# EAGLE design SolderingIronDriver-V1.5-PTH (EAGLE 5.11)
LEFT: PTC; PROJECT: Soldering Iron Driver V1.5; RIGHT: K-TC
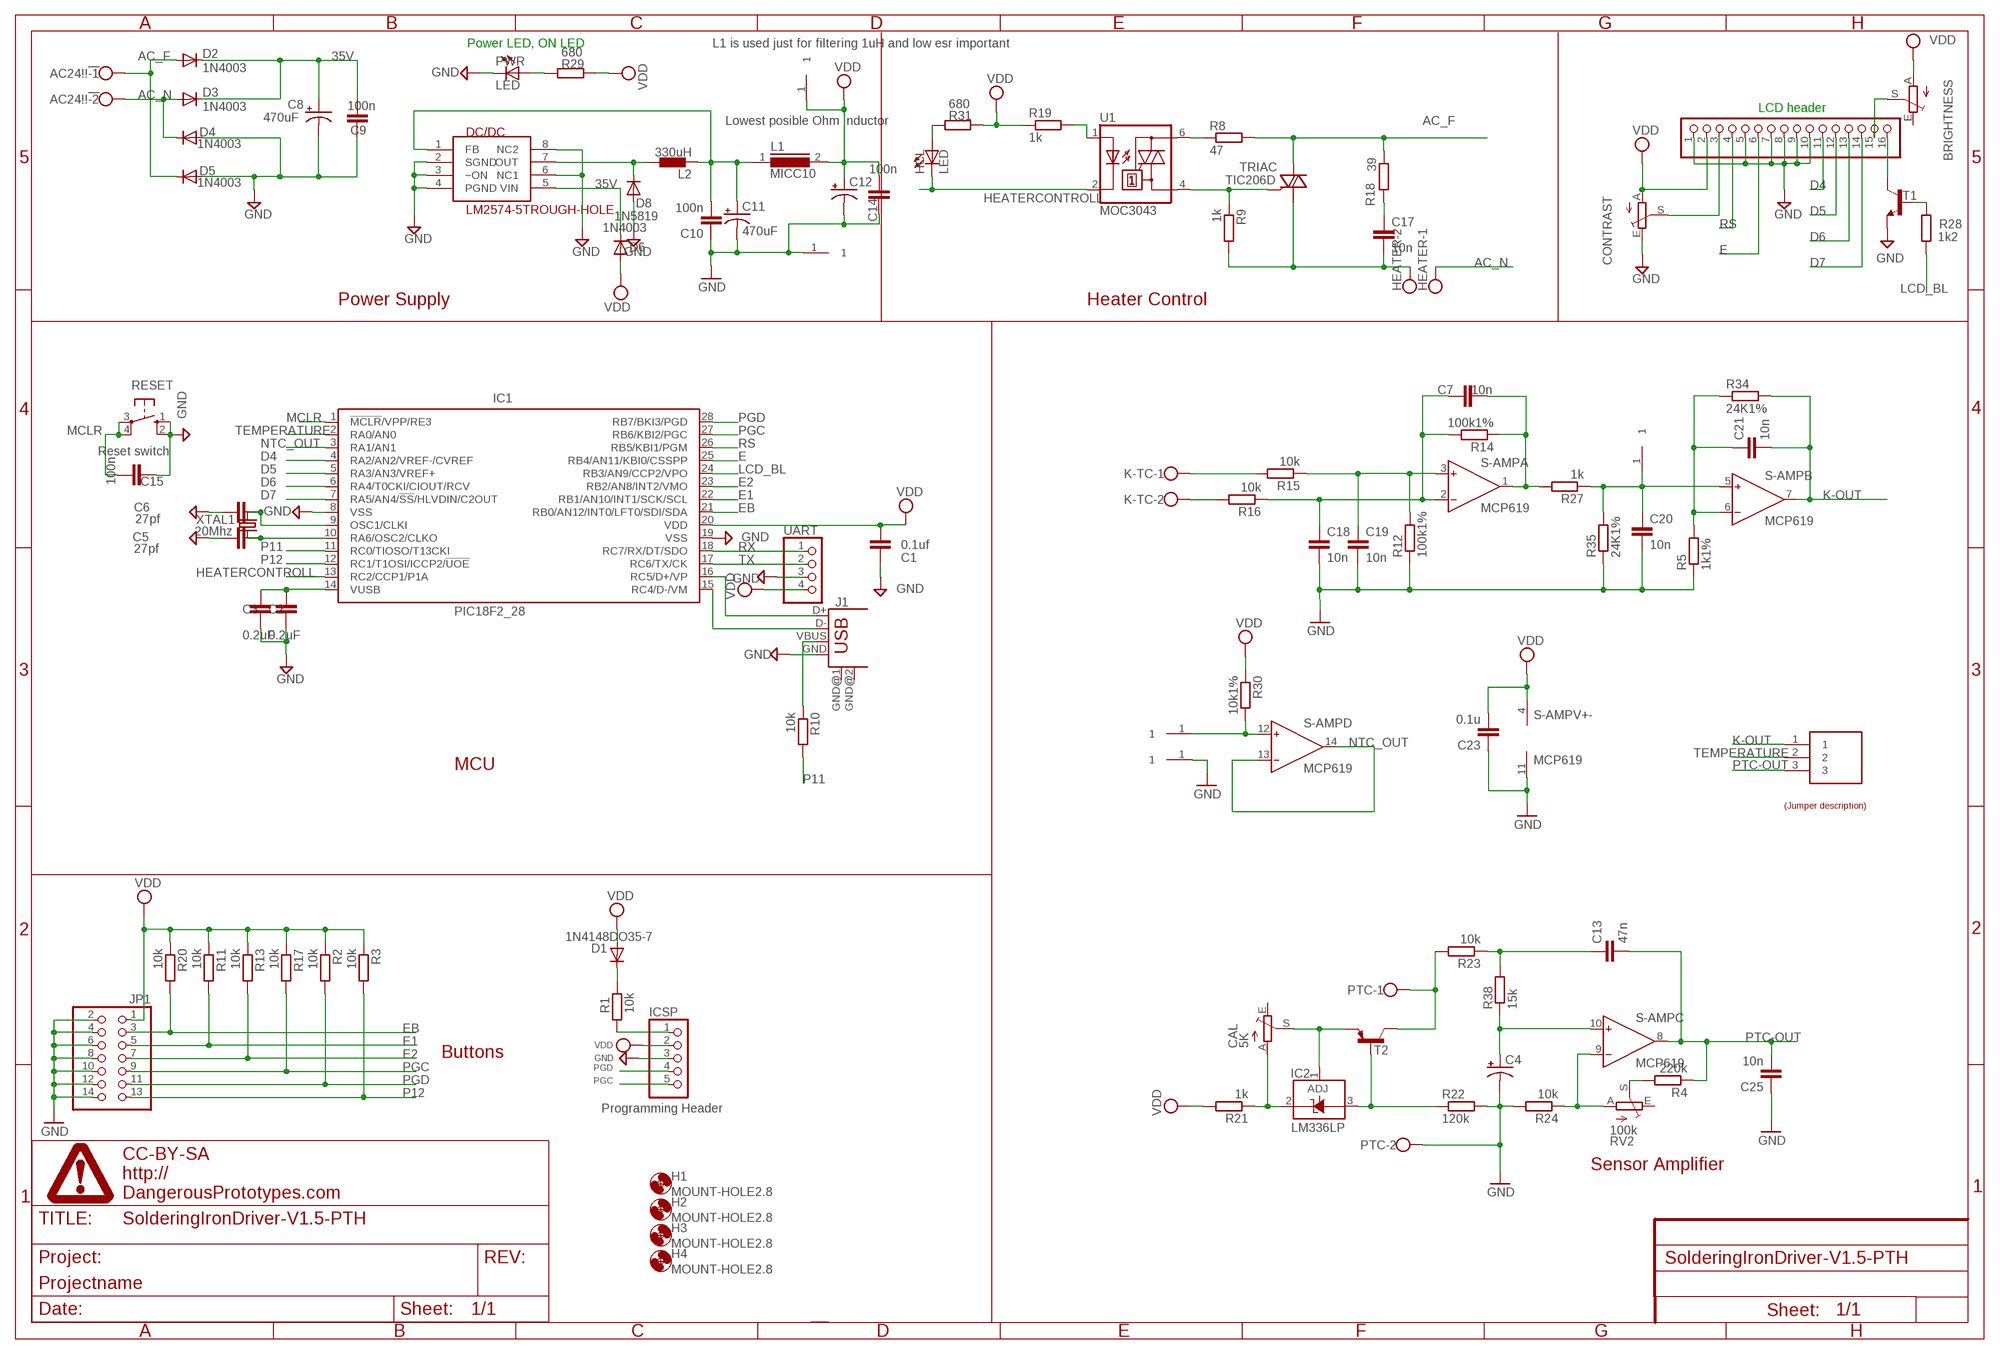
[diagram p0: schematic, sheet 1]

## Parts
5V  HEADER1X1PTH  [M1X1]
AC24!!!  W237-102  [W237-102]
AMP  HEADER1X1PTH  [M1X1]
BRIGHTNESS  TRIM_EU-B25P  [B25P]
C1  0.1uf  CAPDECOUPLING  [DEC]
C2  0.2uF  CAPDECOUPLING  [DEC]
C3  0.2uF  CAPDECOUPLING  [DEC]
C4  CAP_POLPTH2  [CPOL-RADIAL-10UF-25V]
C5  27pf  CAPDECOUPLING  [DEC]
C6  27pf  CAPDECOUPLING  [DEC]
C7  10n  CAPDECOUPLING  [DEC]
C8  470uF  CAP-ELD10-P200  [CAP-D10-P200MIL]
C9  100n  CAPDECOUPLING  [DEC]
C10  100n  CAPDECOUPLING  [DEC]
C11  470uF  CAP-ELD63MP100  [CAP-D6.3MM-P100MIL]
C12  CAP_POLPTH1  [CPOL-RADIAL-100UF-25V]
C13  47n  CAPDECOUPLING  [DEC]
C14  100n  CAPDECOUPLING  [DEC]
C15  100n  CAPDECOUPLING  [DEC]
C17  10n  CAPDECOUPLING  [DEC]
C18  10n  CAPDECOUPLING  [DEC]
C19  10n  CAPDECOUPLING  [DEC]
C20  10n  CAPDECOUPLING  [DEC]
C21  10n  CAPDECOUPLING  [DEC]
C23  0.1u  CAPDECOUPLING  [DEC]
C25  10n  CAPDECOUPLING  [DEC]
CAL  5K  TRIM_EU-RJ9W  [RJ9W]
CONTRAST  TRIM_EU-B25P  [B25P]
D1  1N4148DO35-7  [DO35-7]
D2  1N4003  DIODE-DO41-7.6  [DO41-7.6]
D3  1N4003  DIODE-DO41-7.6  [DO41-7.6]
D4  1N4003  DIODE-DO41-7.6  [DO41-7.6]
D5  1N4003  DIODE-DO41-7.6  [DO41-7.6]
D6  1N4003  DIODE-DO41-7.6  [DO41-7.6]
D8  1N5819  DIODE-DO41-7.6  [DO41-7.6]
DC/DC  LM2574-5TROUGH-HOLE  [DIL-08]
GND  HEADER1X1PTH  [M1X1]
H1  MOUNT-HOLE2.8  [2,8]
H2  MOUNT-HOLE2.8  [2,8]
H3  MOUNT-HOLE2.8  [2,8]
H4  MOUNT-HOLE2.8  [2,8]
HCL  LED  LED3MM  [LED3MM]
HEATER  W237-102  [W237-102]
IC1  PIC18F2_28  [SOCKET-28-3]
IC2  LM336LP  [TO92]
ICSP  PINHD-1X5  [1X05]
JP1  PINHD-2X7  [2X07]
K-TC  W237-102  [W237-102]
L1  MICC10  [MICC10]
L2  330uH  CL330UH  [CW8A]
LCD_HEADER  PINHD-1X16  [1X16]
NTC  HEADER1X1PTH  [M1X1]
ON/OFF2  HEADER1X1PTH  [M1X1]
PTC  W237-102  [W237-102]
PWR  LED  LED3MM  [LED3MM]
R1  10k  R-EU_0204/7  [0204/7]
R2  10k  RESISTORTH  [RTH025W]
R3  10k  RESISTORTH  [RTH025W]
R4  220k  RESISTORTH  [RTH025W]
R5  1k1%  RESISTORTH  [RTH025W]
R8  47  RESISTORTH  [RTH025W]
R9  1k  RESISTORTH  [RTH025W]
R10  10k  RESISTORTH  [RTH025W]
R11  10k  RESISTORTH  [RTH025W]
R12  100k1%  RESISTORTH  [RTH025W]
R13  10k  RESISTORTH  [RTH025W]
R14  100k1%  RESISTORTH  [RTH025W]
R15  10k  RESISTORTH  [RTH025W]
R16  10k  RESISTORTH  [RTH025W]
R17  10k  RESISTORTH  [RTH025W]
R18  39  RESISTORTH  [RTH025W]
R19  1k  RESISTORTH  [RTH025W]
R20  10k  RESISTORTH  [RTH025W]
R21  1k  RESISTORTH  [RTH025W]
R22  120k  RESISTORTH  [RTH025W]
R23  10k  RESISTORTH  [RTH025W]
R24  10k  RESISTORTH  [RTH025W]
R27  1k  RESISTORTH  [RTH025W]
R28  1k2  RESISTORTH  [RTH025W]
R29  680  RESISTORTH  [RTH025W]
R30  10k1%  RESISTORTH  [RTH025W]
R31  680  RESISTORTH  [RTH025W]
R34  24K1%  RESISTORTH  [RTH025W]
R35  24K1%  RESISTORTH  [RTH025W]
R38  15k  RESISTORTH  [RTH025W]
RESET  10-XX  [B3F-10XX]
RV2  100k  TRIM_EU-RJ9W  [RJ9W]
S-AMP  MCP619  [SOCKET-14]
SENSOR_SELECT  HEADER1X3PTH  [M1X3]
T1  BC337-40-NPN-TO92-CBE  [TO92-CBE]
T2  BJT-PNPTO92EBC  [TO92-EBC]
TRIAC  TIC206D  [TO220BV]
U1  MOC3043  MOC3043M  [DIL06]
U$1  DINA4_L  [DP_LOGO]
U$2  JUMP3_DESC  [JUMP3_DESC]
UART  PINHD-1X4  [1X04]
USB  USB  USB-B-H  [USB-B-H]
XTAL1  20Mhz  CRYSTALHC49U70  [HC49U70]

## Nets
35V: C8.+ C9.2 D2.C D3.C D6.C DC/DC.5(VIN)
AC_F: AC24!!!.1 D2.A D5.C R8.2 R18.1 TRIAC.T2(A2)
AC_N: AC24!!!.2 D3.A D4.C HEATER.1
D4: IC1.4(RA2/AN2/VREF-/CVREF) LCD_HEADER.11
D5: IC1.5(RA3/AN3/VREF+) LCD_HEADER.12
D6: IC1.6(RA4/T0CKI/CIOUT/RCV) LCD_HEADER.13
D7: IC1.7(RA5/AN4/!SS!/HLVDIN/C2OUT) LCD_HEADER.14
E: IC1.25(RB4/AN11/KBI0/CSSPP) LCD_HEADER.6
E1: IC1.22(RB1/AN10/INT1/SCK/SCL) JP1.5 R11.2
E2: IC1.23(RB2/AN8/INT2/VMO) JP1.7 R13.2
EB: IC1.21(RB0/AN12/INT0/LFT0/SDI/SDA) JP1.3 R20.2
GND: C1.2 C2.2 C3.2 C4.2(-) C5.2 C6.2 C8.- C9.1 C10.1 C11.- C12.2(-) C14.1 C15.1 C18.2 C19.2 C20.2 C23.1 C25.1 CONTRAST.E D4.A D5.A D8.A DC/DC.2(SGND) DC/DC.3(~ON) DC/DC.4(PGND) DC/DC.6(NC1) DC/DC.8(NC2) GND.1 IC1.8(VSS) IC1.19(VSS) ICSP.3 JP1.2 JP1.4 JP1.6 JP1.8 JP1.10 JP1.12 JP1.14 LCD_HEADER.1 LCD_HEADER.5 LCD_HEADER.7 LCD_HEADER.8 LCD_HEADER.9 LCD_HEADER.10 ON/OFF2.1 PTC.2 PWR.K(C) R5.1 R12.1 R22.2 R24.2 R35.1 RESET.1(S) RESET.2(S1) S-AMP.11(V+-:V-) T1.E UART.3 USB.GND
HEATERCONTROLL: HCL.K(C) IC1.13(RC2/CCP1/P1A) U1.2(C)
K-OUT: C21.2 R34.2 S-AMP.7(B:OUT) SENSOR_SELECT.1
LCD_BL: IC1.24(RB3/AN9/CCP2/VPO) R28.2
MCLR: C15.2 IC1.1(!MCLR!/VPP/RE3) ICSP.1 R1.1 RESET.3(P) RESET.4(P1)
N$1: C6.1 IC1.9(OSC1/CLKI) XTAL1.2
N$2: C5.1 IC1.10(RA6/OSC2/CLKO) XTAL1.1
N$3: R10.1 USB.VBUS
N$4: C10.2 C11.+ DC/DC.1(FB) L1.1 L2.1
N$5: R28.1 T1.B
N$6: HCL.A R31.1
N$7: R4.2 RV2.S
N$10: D1.C R1.2
N$11: LCD_HEADER.16 T1.C
N$12: BRIGHTNESS.S LCD_HEADER.15
N$14: C2.1 C3.1 IC1.14(VUSB)
N$16: K-TC.1 R15.2
N$17: CAL.S IC2.1(ADJ) T2.E
N$19: C17.1 R18.2
N$20: R9.1 TRIAC.G U1.4(A1)
N$21: R8.1 U1.6(A2)
N$22: R19.2 U1.1(A)
N$23: C13.1 R23.1 R38.2
N$24: NTC.1 R30.2 S-AMP.12(D:IN+)
N$25: K-TC.2 R16.2
N$26: C7.1 C18.1 R14.2 R16.1 S-AMP.2(A:IN-)
N$27: C19.1 R12.2 R15.1 S-AMP.3(A:IN+)
N$28: C7.2 R14.1 R27.2 S-AMP.1(A:OUT)
N$29: IC2.3(A) R22.1 T2.B
N$30: CAL.A IC2.2(C) R21.1
N$31: AMP.1 C20.1 R27.1 R35.2 S-AMP.5(B:IN+)
N$32: C21.1 R5.2 R34.1 S-AMP.6(B:IN-)
N$33: C4.1(+) R38.1 S-AMP.10(C:IN+)
N$34: PTC.1 R23.2 T2.C
N$37: R24.1 RV2.A S-AMP.9(C:IN-)
N$38: PWR.A R29.1
N$46: CONTRAST.S LCD_HEADER.3
NTC_OUT: IC1.3(RA1/AN1) S-AMP.13(D:IN-) S-AMP.14(D:OUT)
P11: IC1.11(RC0/TIOSO/T13CKI) R10.2
P12: IC1.12(RC1/T1OSI/ICCP2/!UOE) JP1.13 R3.2
PGC: IC1.27(RB6/KBI2/PGC) ICSP.5 JP1.9 R17.2
PGD: IC1.28(RB7/BKI3/PGD) ICSP.4 JP1.11 R2.2
PTC-OUT: C13.2 C25.2 R4.1 S-AMP.8(C:OUT) SENSOR_SELECT.3
RC4: IC1.15(RC4/D-/VM) USB.D-
RC5: IC1.16(RC5/D+/VP) USB.D+
RS: IC1.26(RB5/KBI1/PGM) LCD_HEADER.4
RX: IC1.18(RC7/RX/DT/SDO) UART.1
SW-OUT: D8.C DC/DC.7(OUT) L2.2
TEMPERATURE: IC1.2(RA0/AN0) SENSOR_SELECT.2
TX: IC1.17(RC6/TX/CK) UART.2
VDD: 5V.1 BRIGHTNESS.A C1.1 C12.1(+) C14.2 C23.2 CONTRAST.A D1.A D6.A IC1.20(VDD) ICSP.2 JP1.1 L1.2 LCD_HEADER.2 R2.1 R3.1 R11.1 R13.1 R17.1 R19.1 R20.1 R21.2 R29.2 R30.1 R31.2 S-AMP.4(V+-:V+) UART.4
WHATEVER: C17.2 HEATER.2 R9.2 TRIAC.T1(A1)
Unconnected: BRIGHTNESS.E CAL.E RV2.E USB.GND@1(GND) USB.GND@2(GND)

## Notes on the sheet
- Power LED, ON LED | L1 is used just for filtering 1uH and low esr important
- LCD header
- Lowest posible Ohm Inductor
- Power Supply | Heater Control
- Reset switch
- J1
- MCU
- Buttons
- Programming Header
- Sensor Amplifier

## Library data of the parts
5V AMP GND NTC ON/OFF2 = dp_devices:HEADER1X1
AC24!!! HEATER K-TC PTC = con-wago-500:W237-102: WAGO SCREW CLAMP; MPN: 237-102; OC_FARNELL: unknown; OC_NEWARK: 70K9898
BRIGHTNESS CONTRAST = pot:TRIM_EU-: POTENTIOMETER
C1-C3 C5-C7 C9 C10 C13-C15 C17-C21 C23 C25 = dp_devices:CAP
C4 C12 = SparkFun:CAP_POL: Capacitor Polarized These are standard SMD and PTH capacitors. Normally 10uF, 47uF, and 100uF in electrolytic and tantalum varieties. Always verify the external diameter of the through hole cap, it varies with capacity, voltage, and manufacturer. The EIA devices should be standard.
C8 C11 = fica:CAP-EL
CAL RV2 = fica2:TRIM_EU-: POTENTIOMETER
D1 = diode:1N4148: DIODE high speed (Philips)
D2-D6 D8 = diode:DIODE-: DIODE
DC/DC = fica:LM2574-5
H1-H4 = holes:MOUNT-HOLE: MOUNTING HOLE with drill center marker
HCL PWR = led:LED: LED OSRAM: - CHIPLED LG R971, LG N971, LY N971, LG Q971, LY Q971, LO R971, LY R971 LH N974, LH R974 LS Q976, LO Q976, LY Q976 LO Q996 - Hyper CHIPLED LW Q18S LB Q993, LB Q99A, LB R99A - SideLED LS A670, LO A670, LY A670, LG A670, LP A670 LB A673, LV A673, LT A673, LW A673 LH A674 LY A675 LS A676, LA A676, LO A676, LY A676, LW A676 LS A679, LY A679, LG A679 - Hyper Micro SIDELED® LS Y876, LA Y876, LO Y876, LY Y876 LT Y87S - SmartLED LW L88C, LW L88S LB L89C, LB L89S, LG L890 LS L89K, LO L89K, LY L89K LS L896, LA L896, LO L896, LY L896 - TOPLED LS T670, LO T670, LY T670, LG T670, LP T670 LSG T670, LSP T670, LSY T670, LOP T670, LYG T670 LG T671, LOG T671, LSG T671 LB T673, LV T673, LT T673, LW T673 LH T674 LS T676, LA T676, LO T676, LY T676, LB T676, LH T676, LSB T676, LW T676 LB T67C, LV T67C, LT T67C, LS T67K, LO T67K, LY T67K, LW E67C LS E67B, LA E67B, LO E67B, LY E67B, LB E67C, LV E67C, LT E67C LW T67C LS T679, LY T679, LG T679 LS T770, LO T770, LY T770, LG T770, LP T770 LB T773, LV T773, LT T773, LW T773 LH T774 LS E675, LA E675, LY E675, LS T675 LS T776, LA T776, LO T776, LY T776, LB T776 LHGB T686 LT T68C, LB T68C - Hyper Mini TOPLED® LB M676 - Mini TOPLED Santana® LG M470 LS M47K, LO M47K, LY M47K Source: http://www.osram.convergy.de LUXEON: - LUMILED® LXK2-PW12-R00, LXK2-PW12-S00, LXK2-PW14-U00, LXK2-PW14-V00 LXK2-PM12-R00, LXK2-PM12-S00, LXK2-PM14-U00 LXK2-PE12-Q00, LXK2-PE12-R00, LXK2-PE12-S00, LXK2-PE14-T00, LXK2-PE14-U00 LXK2-PB12-K00, LXK2-PB12-L00, LXK2-PB12-M00, LXK2-PB14-N00, LXK2-PB14-P00, LXK2-PB14-Q00 LXK2-PR12-L00, LXK2-PR12-M00, LXK2-PR14-Q00, LXK2-PR14-R00 LXK2-PD12-Q00, LXK2-PD12-R00, LXK2-PD12-S00 LXK2-PH12-R00, LXK2-PH12-S00 LXK2-PL12-P00, LXK2-PL12-Q00, LXK2-PL12-R00 Source: www.luxeon.com KINGBRIGHT: KA-3528ASYC Source: www.kingbright.com
IC1 = microchip:PIC18F2*_28: USB Microcontrollers with nanoWatt Technology High-Performance, Enhanced Flash, 28/40/44-Pin, Source: http://ww1.microchip.com/downloads/en/devicedoc/39632c.pdf
IC2 = linear:LM336: 2.5-V INTEGRATED REFERENCE CIRCUITS LM236 Source: http://focus.ti.com/lit/ds/symlink/lm336-2.5.pdf
ICSP = pinhead-2:PINHD-1X5: PIN HEADER
JP1 = pinhead:PINHD-2X7: PIN HEADER
L1 = inductors:MICC10: INDUCTOR
L2 = fica:CL330UH
LCD_HEADER = fica:PINHD-1X16: PIN HEADER
R1 = rcl:R-EU_: RESISTOR, European symbol
R2-R5 R8-R24 R27-R31 R34 R35 R38 = dp_devices:RESISTOR
RESET = switch-omron:10-XX: OMRON SWITCH; MPN: B3F-1000; OC_FARNELL: 176432; OC_NEWARK: 36M3542
S-AMP = fica2:MCP619
SENSOR_SELECT = DP2:HEADER1X3
T1 = transistor:*-NPN-: NPN Transistror BF959 corrected 2008.03.06
T2 = DP2:BJT-PNP: Most commonly used is SOT23-BEC
TRIAC = triac:TIC206: TRIAC Source: http://www.bourns.com/pdfs/tic206.pdf
U1 = optocoupler:MOC30*: 6-Pin DIP Zero-Cross Optoisolators Triac Driver Output (250/400 Volt Peak) Source: http://www.fairchildsemi.com/ds/MO/MOC3043-M.pdf; MF: FAIRCHILD SEMICONDUCTOR; MPN: MOC3043-M; OC_FARNELL: 1021371; OC_NEWARK: 72K8900
U$1 = DP2:DINA4_L: A4 DP frame Standard Dangerous Prototypes schematic frame. Automagically adds the DP logo and standard texts to the PCB Use the atrribute in the schematic editor to change the fields.; FF1: fulfillment by; FF2: Seeed Studio; FF3: www.seeedstudio.com; LICENSE: CC-BY-SA; PROJECT: Projectname; URL1: http://; URL2: DangerousPrototypes.com
U$2 = DP2:JUMP3_DESC: Nice formatted three legged jumperdescription Use attributes to change the values LEFT = With jumper to the left RIGHT = With jumper to the right; LEFT: left; RIGHT: right
UART = pinhead:PINHD-1X4: PIN HEADER
USB = con-usb-2:USB: USB Connectors
XTAL1 = crystal:CRYSTAL: CRYSTAL; OC_FARNELL: unknown; OC_NEWARK: unknown

## Board
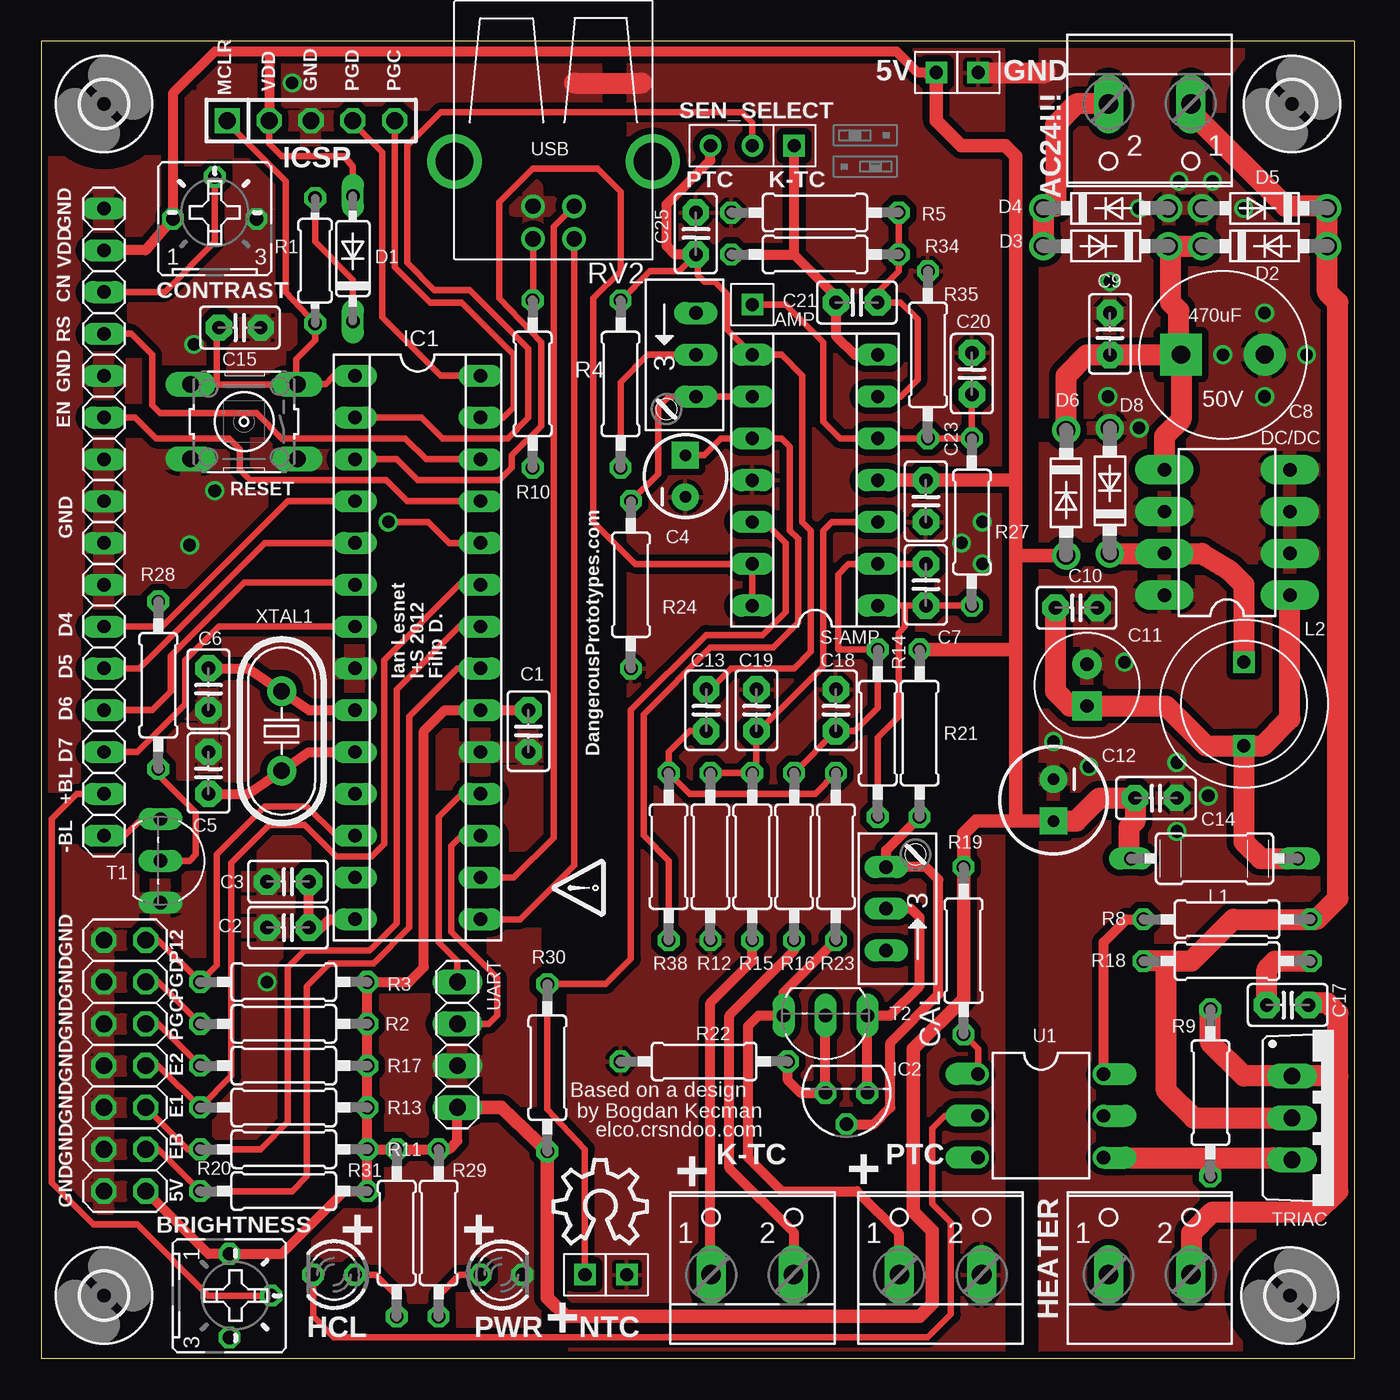
[diagram p1: board, top side]
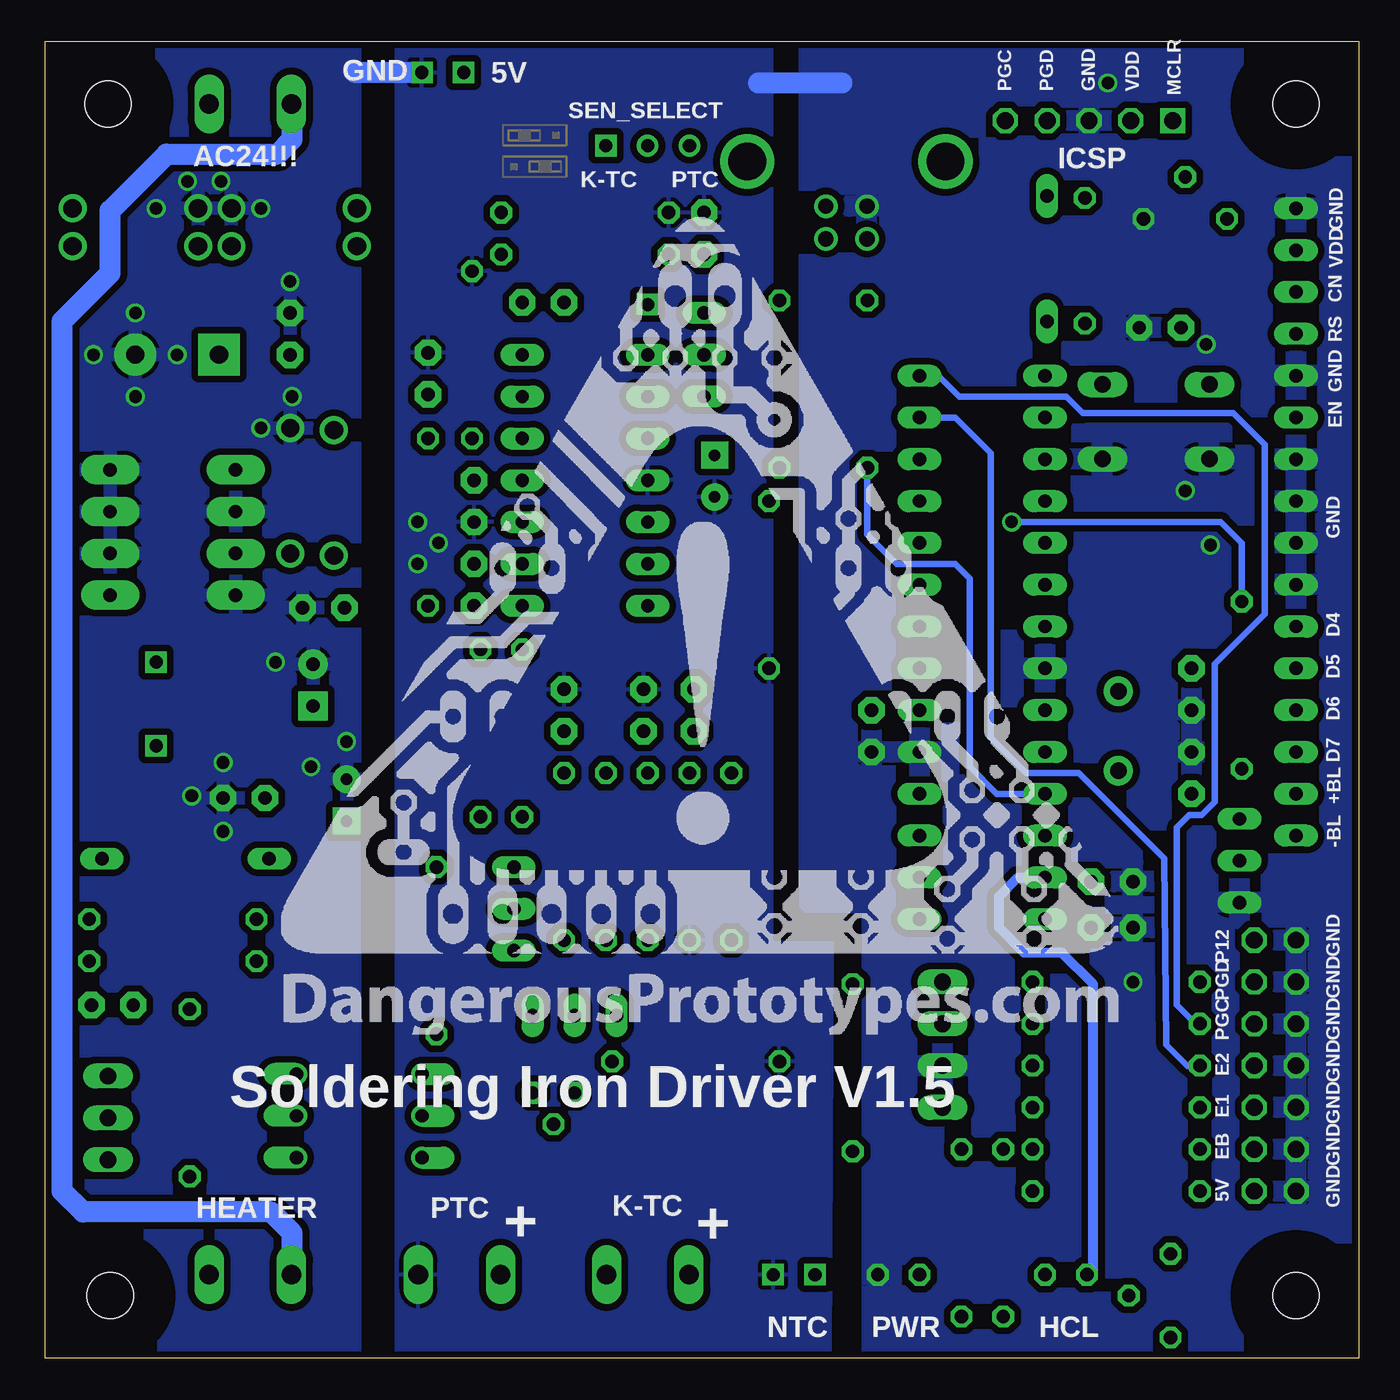
[diagram p2: board, bottom side, seen from below]

Size 79.76 x 80.01 mm. Coordinates in mm from the lower left corner, seen from the top.
Outline: 0,0 79.76,0 79.76,80.01 0,80.01 0,0
Copper layers (1*16): Top 0.035mm / dielectric 1.5mm / Bottom 0.035mm
Design rules "Fusion_eagle_rule_v1.1 *": minimum track width 6mil, minimum drill 12mil, track to track 10mil, track to pad 10mil, pad to pad 10mil, via to via 10mil, smd to smd 0mil, copper to edge 10mil, drill to drill 10mil, minimum pad ring 10mil, minimum via ring 6mil, stop-mask expansion 2mil, vias tented up to drill 100mil, thermal gap 10mil

### Footprints (pad centres in the part's own frame; a part is rotated, then mirrored left to right if it is on the bottom)
M1X1 = drill 0.8 square: 1 0,0
W237-102 = drill 1.194 long: 1 -2.5,-1.27; 2 2.5,-1.27
B25P = drill 0.813 octagon: A -2.54,0; E 2.54,0; S 0,2.54
DEC = drill 0.813 pad 1.6 octagon: 1 -1.27,0; 2 1.27,0
CPOL-RADIAL-10UF-25V = drill 0.7 pad 1.651 square: 1 1.27,0 | drill 0.7 pad 1.651 round: 2 -1.27,0
CAP-D10-P200MIL = drill 1.1 pad 2.54 square: + -2.54,0 | drill 1.1 pad 2.54 round: - 2.54,0
CAP-D6.3MM-P100MIL = drill 0.8 pad 1.778 square: + -1.27,0 | drill 0.8 pad 1.778 round: - 1.27,0
CPOL-RADIAL-100UF-25V = drill 0.7 pad 1.651 square: 1 1.27,0 | drill 0.7 pad 1.651 round: 2 -1.27,0
RJ9W = drill 0.813 long: A 2.54,0.635; E -2.54,0.635; S 0,0.635
DO35-7 = drill 0.813 long: A 3.81,0; C -3.81,0
DO41-7.6 = drill 1.1 pad 1.7 round: A 3.81,0; C -3.81,0
DIL-08 = drill 0.813 pad 1.778 long: 1 -3.81,-3.81; 2 -1.27,-3.81; 3 1.27,-3.81; 4 3.81,-3.81; 5 3.81,3.81; 6 1.27,3.81; 7 -1.27,3.81; 8 -3.81,3.81
2,8 = hole 2.8: 0,0
LED3MM = drill 0.813 octagon: A -1.27,0; K 1.27,0
SOCKET-28-3 = drill 0.813 long: 1 -16.51,-3.81; 2 -13.97,-3.81; 3 -11.43,-3.81; 4 -8.89,-3.81; 5 -6.35,-3.81; 6 -3.81,-3.81; 7 -1.27,-3.81; 8 1.27,-3.81; 9 3.81,-3.81; 10 6.35,-3.81; 11 8.89,-3.81; 12 11.43,-3.81; 13 13.97,-3.81; 14 16.51,-3.81; 15 16.51,3.81; 16 13.97,3.81; 17 11.43,3.81; 18 8.89,3.81; 19 6.35,3.81; 20 3.81,3.81; 21 1.27,3.81; 22 -1.27,3.81; 23 -3.81,3.81; 24 -6.35,3.81; 25 -8.89,3.81; 26 -11.43,3.81; 27 -13.97,3.81; 28 -16.51,3.81
TO92 = drill 0.813 octagon: 1 -1.27,0; 2 0,1.905; 3 1.27,0
1X05 = drill 1.016 square: 1 -5.08,0 | drill 1.016 octagon: 2 -2.54,0; 3 0,0; 4 2.54,0; 5 5.08,0
2X07 = drill 1.016 octagon: 1 -7.62,-1.27; 2 -7.62,1.27; 3 -5.08,-1.27; 4 -5.08,1.27; 5 -2.54,-1.27; 6 -2.54,1.27; 7 0,-1.27; 8 0,1.27; 9 2.54,-1.27; 10 2.54,1.27; 11 5.08,-1.27; 12 5.08,1.27; 13 7.62,-1.27; 14 7.62,1.27
MICC10 = drill 0.813 long: 1 -5.08,0; 2 5.08,0
CW8A = drill 0.8 square: 1 -2.54,0; 2 2.54,0
1X16 = drill 0.813 long: 1 -19.05,0; 2 -16.51,0; 3 -13.97,0; 4 -11.43,0; 5 -8.89,0; 6 -6.35,0; 7 -3.81,0; 8 -1.27,0; 9 1.27,0; 10 3.81,0; 11 6.35,0; 12 8.89,0; 13 11.43,0; 14 13.97,0; 15 16.51,0; 16 19.05,0
0204/7 = drill 0.813 octagon: 1 -3.81,0; 2 3.81,0
RTH025W = drill 0.813 octagon: 1 -5.08,0; 2 5.08,0
B3F-10XX = drill 1.016 long: 1 -3.251,2.261; 2 3.251,2.261; 3 -3.251,-2.261; 4 3.251,-2.261
SOCKET-14 = drill 0.813 long: 1 -7.62,-3.81; 2 -5.08,-3.81; 3 -2.54,-3.81; 4 0,-3.81; 5 2.54,-3.81; 6 5.08,-3.81; 7 7.62,-3.81; 8 7.62,3.81; 9 5.08,3.81; 10 2.54,3.81; 11 0,3.81; 12 -2.54,3.81; 13 -5.08,3.81; 14 -7.62,3.81
M1X3 = drill 0.8 square: 1 0,0 | drill 0.8 round: 2 2.54,0; 3 5.08,0
TO92-CBE = drill 0.813 long: B 0,0; C -2.54,0; E 2.54,0
TO92-EBC = drill 0.813 long: B 0,0; C 2.54,0; E -2.54,0
TO220BV = drill 1.016 long: G 2.54,-2.54; T1 -2.54,-2.54; T2 0,-2.54
DIL06 = drill 0.813 offset: 1 -2.54,-3.81; 2 0,-3.81; 3 2.54,-3.81; 4 2.54,3.81; 5 0,3.81; 6 -2.54,3.81
1X04 = drill 1.016 long: 1 -3.81,0; 2 -1.27,0; 3 1.27,0; 4 3.81,0
USB-B-H = drill 0.914 round: D+ 0,1.25; D- 1.981,1.25; GND 0,-1.25; VBUS 1.981,-1.25 | drill 2.286 round: GND@1 -2.718,6.02; GND@2 -2.718,-6.02
HC49U70 = drill 1 pad 1.778 round: 1 -2.413,0; 2 2.413,0

### Placement (x,y rotation side)
5V  54.36,78.11 0 top
AC24!!!  67.31,74.93 180 top
AMP  43.18,64.01 90 top
BRIGHTNESS  11.43,3.81 270 top
C1  29.59,38.1 270 top
C2  14.99,26.16 180 top
C3  14.99,28.96 180 top
C4  39.12,53.59 90 top
C5  10.16,35.56 90 top
C6  10.16,40.64 270 top
C7  53.72,46.99 270 top
C8  71.75,60.96 0 top
C9  64.9,62.23 270 top
C10  62.87,45.59 180 top
C11  63.5,40.89 90 top
C12  61.47,33.91 270 top
C13  40.39,39.37 90 top
C14  67.69,34.04 180 top
C15  12.06,62.61 180 top
C17  75.69,21.46 0 top
C18  48.26,39.37 90 top
C19  43.43,39.37 90 top
C20  56.52,59.82 90 top
C21  49.53,64.14 180 top
C23  53.72,52.07 90 top
C25  39.75,68.33 270 top
CAL  51.94,27.3 90 top
CONTRAST  10.54,69.22 0 top
D1  18.92,66.8 90 top
D2  74.3,67.56 0 top
D3  64.64,67.56 180 top
D4  64.64,69.85 0 top
D5  74.3,69.85 180 top
D6  62.23,52.58 270 top
D8  64.9,52.7 90 top
DC/DC  72.01,50.16 90 top
GND  56.9,78.11 0 top
H1  75.82,3.81 0 top
H2  75.95,76.2 0 top
H3  3.81,3.81 0 top
H4  3.81,76.2 0 top
HCL  17.78,5.08 180 top
HEATER  67.31,6.35 0 top
IC1  22.86,43.18 270 top
IC2  48.9,16.13 180 top
ICSP  16.38,75.18 0 top
JP1  5.08,17.78 90 top
K-TC  43.18,6.35 0 top
L1  71.25,30.35 180 top
L2  73.03,39.75 90 top
LCD_HEADER  3.81,50.8 270 top
NTC  33.02,5.08 0 top
ON/OFF2  35.56,5.08 0 top
PTC  54.61,6.35 0 top
PWR  27.94,5.08 0 top
R1  16.64,66.67 90 top
R2  14.73,20.32 180 top
R3  14.73,22.86 180 top
R4  35.18,59.18 270 top
R5  46.99,69.6 0 top
R8  72.01,26.67 0 top
R9  70.99,16.13 90 top
R10  29.84,59.18 270 top
R11  14.73,12.7 180 top
R12  40.64,30.48 90 top
R13  14.73,15.24 180 top
R14  50.8,37.97 90 top
R15  43.18,30.48 270 top
R16  45.72,30.48 270 top
R17  14.73,17.78 180 top
R18  72.01,24.13 0 top
R19  56.01,24.77 270 top
R20  14.73,10.16 180 top
R21  53.34,37.97 90 top
R22  40.26,18.03 180 top
R23  48.26,30.48 270 top
R24  35.81,46.99 270 top
R27  56.52,50.8 270 top
R28  7.11,40.89 90 top
R29  24.13,7.62 90 top
R30  30.73,17.65 90 top
R31  21.59,7.62 90 top
R34  46.99,67.06 180 top
R35  53.85,60.96 270 top
R38  38.1,30.48 90 top
RESET  12.32,56.9 180 top
RV2  39.12,60.96 270 top
S-AMP  46.99,53.34 90 top
SENSOR_SELECT  45.72,73.66 180 top
T1  7.24,30.23 270 top
T2  47.62,20.83 180 top
TRIAC  78.49,14.61 270 top
U1  60.71,14.73 270 top
U$1  33.66,28.57 90 top
U$2  53.21,73.03 0 top
U$3  JUMP3_DESC  [JUMP3_DESC]  46.86,73.03 0 bottom
U$4  [DP_LOGO_ART_2X2]  65.41,19.68 0 bottom
U$5  [OSHW_10X200_NOTEXT]  31.11,6.99 0 top
UART  25.27,19.05 270 top
USB  31.11,69.98 270 top
XTAL1  14.61,38.1 90 top

### Tracks (layer width: path | path; a pad name or v marks a point on that pad's centre or on a via)
35V
  Top 1.27: DC/DC.5 68.2,56.01 69.22,57.02 C8.+ | C8.+ C9.2 63.5,60.96 62.23,59.69 D6.C | C8.+ 69.09,61.09 69.09,63.63 68.58,64.14 68.58,67.44 D3.C D2.C
AC_F
  Top 1.27: 68.71,24.13 R18.1 | 68.71,24.13 69.85,24.13 72.39,26.67 R8.2 77.47,26.67 78.74,27.94 78.74,64.14 78.11,64.77 D2.A D5.C 77.98,69.98 75.56,69.98 69.81,75.73 AC24!!!.1 | TRIAC.T2 69.98,14.61 68.33,16.26 68.33,23.75 68.71,24.13
AC_N
  Top 1.27: AC24!!!.2 62.87,76.2 61.59,74.93 61.59,69.98 D4.C D3.A
  Bottom 1.27: 64.9,4.99 HEATER.1 64.77,5.12 64.77,7.62 66.04,8.89 77.47,8.89 78.74,10.16 78.74,62.99 75.82,65.91 75.82,69.72 72.39,73.15 65.66,73.15 64.77,74.04 64.77,76.16 AC24!!!.2
D4
  Top 0.406: LCD_HEADER.11 7.37,44.45 14.99,52.07 IC1.4
D5
  Top 0.406: IC1.5 13.59,49.53 5.97,41.91 LCD_HEADER.12
D6
  Top 0.406: LCD_HEADER.13 6.73,39.37 7.87,40.51 7.87,42.67 12.32,47.12 18.92,47.12 IC1.6
D7
  Top 0.406: IC1.7 10.79,44.45 8.76,42.42 8.76,39.75 5.84,36.83 LCD_HEADER.14
E
  Top 0.406: LCD_HEADER.6 5.71,57.15 6.99,55.88 11.43,55.88 12.06,55.24 12.06,53.98 12.7,53.34 20.95,53.34 22.23,52.07 IC1.25
E1
  Top 0.406: IC1.22 25.4,44.45 21.59,40.64 21.59,26.42 19.94,24.77 16,24.77 14.99,23.75 14.99,14.35 13.34,12.7 R11.2 8.89,12.7 JP1.5
E2
  Top 0.406: IC1.23 25.4,46.99 20.83,42.42 20.83,31.24 20.07,30.48 17.91,30.48 16,32.38 13.84,32.38 11.56,30.1 11.56,17.14 R13.2 7.11,17.78 JP1.7
EB
  Top 0.406: IC1.21 25.27,41.91 22.35,38.99 22.35,26.16 20.19,24 17.53,24 16.13,22.61 16.13,11.05 15.24,10.16 R20.2 7.11,12.7 JP1.3
GND  (via drill 0.76)
  Top 1.27: 32.38,77.47 36.45,77.47 | 57.02,78.11 60.96,78.11
  Bottom 1.27: 57.15,78.11 60.96,78.11 | 31.37,77.47 36.45,77.47
  other vias: 73.03,69.85 66.67,69.85 71.12,71.5 74.3,63.5 74.3,58.42 69.09,71.5 76.83,60.96 64.77,58.42 71.75,60.96 66.67,56.52 64.9,65.41 9.02,49.4 10.54,52.7 9.27,61.59 61.47,37.47 63.63,35.94 65.79,42.29 55.88,49.53 57.15,48.26 57.15,50.8 13.72,22.86 15.24,77.47 68.96,36.2 70.87,34.16 68.96,32
  pour Top (isolate 0.406): 0,80.01 33.4,80.01 33.66,56.13 33.4,27.56 29.72,27.56 29.72,0 0,0
  pour Bottom (isolate 0.406): 0,80.01 33.4,80.01 33.4,27.69 29.59,27.69 29.59,0.13 0,0.13
  pour Bottom (isolate 0.406): 35.69,80.01 35.69,25.27 32,25.27 32.13,0 58.42,0.13 58.42,80.26
  pour Bottom (isolate 0.406): 60.96,80.01 79.76,80.01 79.76,0 60.96,0
  pour Top (isolate 0.406): 60.96,80.01 79.76,80.01 79.76,0 60.96,0
  pour Top (isolate 0.406): 35.69,80.01 58.42,80.14 58.42,0.13 32.13,0 32,25.27 35.69,25.27
HEATERCONTROLL
  Top 0.406: HCL.K 16.38,4.95 16.38,4.83 16.51,4.7 16.51,2.54 17.78,1.27 53.85,1.27 55.24,2.67 55.24,8.26 54.1,9.4 54.1,13.97 54.86,14.73 U1.2
  Bottom 0.61: IC1.13 20.7,29.21 21.84,28.07 21.84,26.16 20.32,24.64 18.03,24.64 16.13,22.73 16.13,5.46 HCL.K
K-OUT
  Top 0.61: S-AMP.7 49.4,60.96 48.26,62.1 C21.2 48.26,64.52 45.72,67.06 | 45.72,67.06 SENSOR_SELECT.1 | R34.2 45.72,67.06
LCD_BL  (via drill 0.76)
  Top 0.406: v21.08,50.8 23.5,50.8 24.77,49.53 IC1.24
  Bottom 0.406: R28.2 7.11,49.53 8.38,50.8 v21.08,50.8
MCLR
  Top 0.406: IC1.1 17.78,59.69 17.27,59.18 15.6,59.18 RESET.3 | RESET.4 10.67,59.16 | 10.67,59.16 RESET.3 | RESET.3 15.49,59.23 15.49,60.71 16.64,61.85 R1.1 14.86,64.77 14.86,71.5 11.3,75.06 ICSP.1 | C15.2 10.67,62.48 10.67,59.16
N$1
  Top 0.61: IC1.9 16.26,39.37 XTAL1.2 12.57,41.91 C6.1
N$2
  Top 0.61: IC1.10 16.26,36.83 XTAL1.1 12.57,34.29 C5.1
N$3
  Top 0.406: USB.VBUS 29.86,64.28 R10.1
N$4
  Top 1.27: DC/DC.1 75.82,38.86 74.17,37.21 L2.1 | C10.2 61.59,40.51 62.48,39.62 C11.+ 68.33,39.62 70.74,37.21 L2.1 | L1.1 74.04,30.35 73.03,31.37 L2.1
N$5
  Top 0.406: T1.B 9.02,30.23 9.4,30.61 9.4,33.15 7.37,35.18 7.37,35.56 R28.1
N$6
  Top 0.406: HCL.A 20.32,5.08 21.59,3.81 R31.1
N$7
  Top 0.406: R4.2 35.18,59.31 36.83,60.96 RV2.S
N$10
  Top 0.406: R1.2 16.64,67.82 18.92,65.53 D1.C
N$11
  Top 0.406: LCD_HEADER.16 5.08,31.75 6.1,32.77 T1.C
N$12
  Top 0.406: LCD_HEADER.15 2.16,34.29 0.64,32.77 0.64,10.67 3.17,8.13 5.84,8.13 10.16,3.81 BRIGHTNESS.S
N$14
  Top 0.61: IC1.14 17.53,26.67 17.02,26.16 C2.1 C3.1
N$16
  Top 0.61: K-TC.1 40.64,5.12 40.64,21.59 43.18,24.13 R15.2
N$17
  Top 0.61: IC2.1 T2.E 51.56,20.83 53.34,22.61 53.34,26.8 52.83,27.3 CAL.S
N$19
  Top 1.27: C17.1 74.42,23.62 74.93,24.13 R18.2
N$20
  Top 1.27: U1.4 71.12,12.19 | 71.12,12.19 74.8,12.19 TRIAC.G | 71.12,12.19 70.99,11.68 R9.1
N$21
  Top 0.61: R8.1 65.91,26.67 64.52,25.27 U1.6
N$22
  Top 0.406: R19.2 56.9,18.8 U1.1
N$23
  Top 0.406: C13.1 39.37,38.1 38.1,36.83 R38.2 39.37,34.29 46.99,34.29 R23.1
N$24
  Top 0.406: S-AMP.12 43.94,50.8 45.21,49.53 45.21,45.34 43.81,43.94 40.39,43.94 35.81,39.37 35.81,24.26 34.29,22.73 R30.2 30.73,15.11 33.02,12.7 NTC.1
N$25
  Top 0.61: R16.2 45.72,24.77 41.78,20.83 41.78,11.56 45.72,7.62 45.72,5.12 K-TC.2
N$26
  Top 0.406: C7.1 S-AMP.2 49.02,48.26 48.39,47.62 48.39,43.05 R14.2 50.8,39.5 49.4,38.1 C18.1 R16.1
N$27
  Top 0.406: S-AMP.3 48.01,50.8 47.5,50.29 47.5,42.04 43.56,38.1 C19.1 43.43,35.81 R15.1 R12.2
N$28
  Top 0.406: 52.32,45.72 S-AMP.1 | 52.32,45.72 C7.2 R27.2 | R14.1 50.8,37.72 52.07,38.99 52.07,44.07 52.45,44.45 52.45,45.59 52.32,45.72
N$29
  Top 0.61: T2.B IC2.3 46.1,16.13 45.34,16.89 R22.1
N$30
  Top 0.61: IC2.2 50.55,14.22 51.56,15.24 51.56,19.18 54.48,22.1 54.48,29.08 53.72,29.84 CAL.A 51.31,30.86 R21.1
N$31
  Top 0.406: AMP.1 45.21,64.01 47.5,61.72 47.5,56.9 48.51,55.88 S-AMP.5 R35.2 R27.1 C20.1
N$32
  Top 0.406: R5.2 R34.1 52.07,66.04 50.8,64.77 C21.1 52.2,64.14 53.21,63.12 53.21,59.44 52.2,58.42 S-AMP.6
N$33
  Top 0.406: R38.1 38.1,30.23 36.58,31.75 36.58,39.12 40.64,43.18 44.45,43.18 45.97,44.7 45.97,49.78 45.47,50.29 45.47,55.37 44.96,55.88 S-AMP.10 41.27,55.88 40.26,54.86 C4.1
N$34
  Top 0.61: PTC.1 52.07,5.12 52.07,7.62 49.53,10.16 44.96,10.16 42.93,12.19 42.93,20.19 43.56,20.83 T2.C 45.09,22.23 R23.2
N$37
  Top 0.406: S-AMP.9 RV2.A 38.1,58.42 37.47,57.78 37.47,53.72 R24.1
N$38
  Top 0.406: PWR.A 25.4,5.08 24.13,3.81 R29.1
N$46
  Top 0.406: LCD_HEADER.3 7.49,64.77 10.54,67.82 CONTRAST.S
NTC_OUT
  Top 0.406: S-AMP.14 S-AMP.13 36.07,48.26 33.53,50.8 33.53,64.39 35.18,66.04 35.18,70.87 33.78,72.26 29.84,72.26 27.81,70.23 27.81,64.39 30.35,61.72 30.35,56.64 28.57,54.86 28.57,54.1 27.81,53.34 22.86,53.34 21.59,54.61 IC1.3
P11
  Bottom 0.406: R10.2 29.84,50.04 28.07,48.26 24.51,48.26 23.62,47.37 23.62,35.94 21.97,34.29 IC1.11
P12
  Top 0.406: JP1.13 7.11,25.4 R3.2 10.67,23.88 10.67,30.61 13.59,33.53 16.13,33.53 17.91,31.75 IC1.12
PGC
  Top 0.406: ICSP.5 21.46,66.29 23.62,64.14 25.53,64.14 28.7,60.96 28.7,57.78 28.07,57.15 IC1.27 | JP1.9 7.11,20.32 R17.2
  Bottom 0.406: IC1.27 24.51,57.15 22.35,54.99 22.35,37.72 20.19,35.56 17.02,35.56 11.81,30.35 11.68,19.05 10.41,17.78 R17.2
PGD
  Top 0.406: ICSP.4 18.92,75.06 20.7,73.28 20.7,63.25 24.26,59.69 IC1.28 | JP1.11 7.11,22.86 R2.2
  Bottom 0.406: IC1.28 25.53,59.69 24.26,58.42 17.78,58.42 16.76,57.4 7.62,57.4 5.71,55.5 5.71,45.21 8.76,42.16 8.76,33.78 9.53,33.02 10.29,33.02 11.05,32.26 11.05,21.46 9.91,20.32 R2.2
PTC-OUT
  Top 0.406: C13.2 40.39,40.39 41.91,41.91 45.72,41.91 46.74,42.93 46.74,50.29 46.23,50.8 46.23,59.69 44.96,60.96 S-AMP.8 41.66,62.48 41.66,64.64 40.89,65.41 40.26,65.41 39.88,65.79 39.88,66.93 C25.2 38.73,66.04 36.96,66.04 R4.1
  Top 0.61: C25.2 38.48,67.06 37.97,67.56 37.97,70.1 40.64,72.77 SENSOR_SELECT.3
RC4
  Top 0.406: USB.D- 32.37,29.95 29.08,26.67 IC1.15
RC5
  Top 0.406: IC1.16 28.7,29.21 31.11,31.62 31.11,68.73 USB.D+
RS
  Top 0.406: IC1.26 23.37,54.61 22.1,55.88 14.61,55.88 13.08,57.4 7.24,57.4 6.73,57.91 6.73,60.96 5.46,62.23 LCD_HEADER.4
RX
  Top 0.406: IC1.18 25.53,34.29 24.13,32.89 24.13,25.27 25.27,24.13 UART.1
SW-OUT
  Top 1.27: D8.C DC/DC.7 70.48,48.9 72.14,47.88 73.03,46.99 L2.2
TEMPERATURE
  Top 0.406: IC1.2 23.11,57.15 24.38,55.88 28.32,55.88 29.59,57.15 29.59,61.34 26.04,64.9 23.88,64.9 22.23,66.55 22.23,73.66 24.26,75.69 42.55,75.69 43.18,75.06 SENSOR_SELECT.2
TX
  Top 0.406: IC1.17 25.53,31.75 24.89,31.11 24.89,25.91 27.69,23.11 27.69,20.83 27.18,20.32 UART.2
VDD
  Top 0.406: ICSP.2 13.84,73.79 14.61,73.03 18.41,73.03 18.92,72.39 D1.A
  Top 0.61: C1.1 IC1.20 24.51,39.37 23.24,38.1 23.24,23.75 22.35,22.86 R3.1 R2.1 R17.1 R13.1 R11.1 | 13.84,79.38 51.94,79.38 53.21,78.11 53.72,78.11 54.36,77.47 | 13.84,79.38 10.54,79.38 8,76.83 CONTRAST.A 6.35,67.31 LCD_HEADER.2 | 13.84,79.38 ICSP.2 | R11.1 R20.1 18.41,10.16 14.61,6.35 BRIGHTNESS.A 10.16,6.35 JP1.1 | R11.1 R31.2 R29.2 24.77,12.7 25.27,13.21 UART.4
  Top 0.813: S-AMP.4 C23.2 59.18,53.34 | UART.4 27.94,15.24 R30.1 30.73,3.68 31.88,2.54 53.34,2.54 54.1,3.3 54.1,7.75 52.96,8.89 52.96,18.8 56.01,21.84 R19.1 56.01,31.88 56.77,32.64 58.93,32.64 | 58.93,32.64 C12.1 | 5V.1 54.36,77.47 54.36,75.18 55.88,73.66 58.55,73.66 59.18,73.03 59.18,53.34 | 59.18,43.18 59.18,32.89 58.93,32.64 | 59.18,43.18 59.18,48.77 | 59.18,48.77 59.18,53.34 | 59.18,48.77 D6.A | R21.2 59.05,43.05 59.18,43.18
  Top 1.27: L1.2 66.04,30.48 66.04,32.26 66.42,32.64 C14.2 64.26,34.04 62.87,32.64 C12.1
WHATEVER
  Top 1.27: HEATER.2 69.85,5.12 69.85,7.62 71.12,8.89 77.47,8.89 78.74,10.16 78.74,17.14 | 78.74,17.14 78.74,20.95 78.11,21.59 77.09,21.59 C17.2 | 78.74,17.14 TRIAC.T1 73.03,17.14 70.99,19.18 R9.2

### Text on the board
bPlace: Soldering Iron Driver V1.5
tNames: MCLR | VDD | GND | PGD | PGC | SEN_SELECT | PTC | K-TC | GND | VDD | CN | RS | GND | 50V | EN | GND | D4 | D5 | Ian Lesnet | I+S 2012 | Filip D. | D6 | DangerousPrototypes.com | D7 | +BL | -BL | GND | P12 | GND | PGD | GND | PGC | GND | E2 | Based on a design | E1 | by Bogdan Kecman | GND | elco.crsndoo.com | GND | EB | 5V | + | + | GND | + | + | +
bNames: GND | MCLR | VDD | GND | PGD | PGC | 5V | SEN_SELECT | AC24!!! | ICSP | PTC | K-TC | GND | VDD | CN | RS | GND | EN | GND | D4 | D5 | D6 | D7 | +BL | -BL | GND | P12 | GND | PGD | GND | PGC | GND | E2 | E1 | GND | GND | EB | 5V | GND | K-TC | PTC | HEATER | + | + | HCL | PWR | NTC